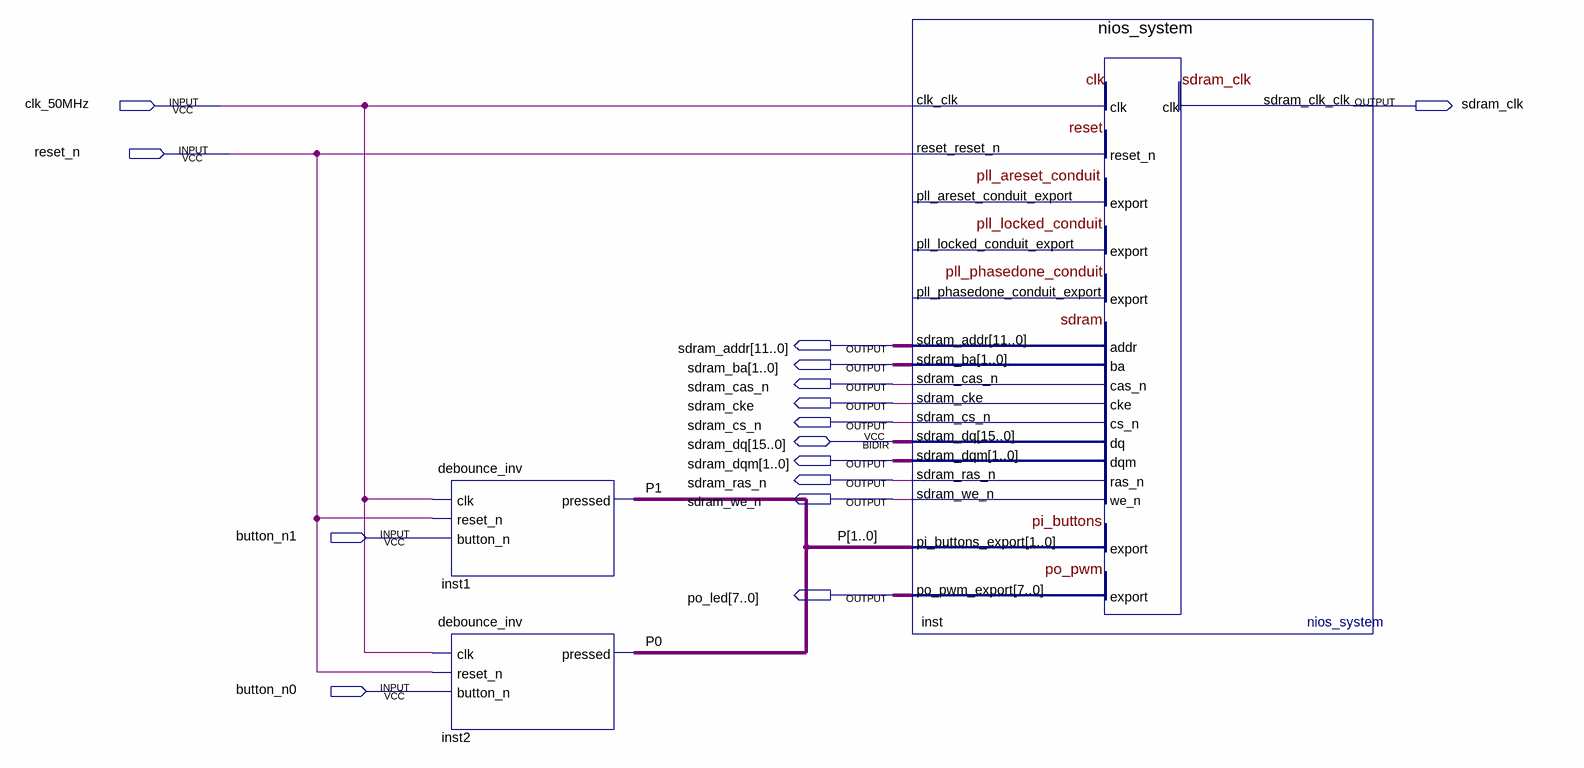
[diagram p0: schematic sheet]
// Quartus schematic nios2_crypt.bdf as structural Verilog: 3 symbols, 15 pins
module nios2_crypt (
  input  clk_50MHz,
  input  reset_n,
  input  button_n1,
  input  button_n0,
  inout  [15:0] sdram_dq,
  output sdram_clk,
  output [11:0] sdram_addr,
  output [1:0] sdram_ba,
  output sdram_cas_n,
  output sdram_cke,
  output sdram_cs_n,
  output [1:0] sdram_dqm,
  output sdram_ras_n,
  output sdram_we_n,
  output [7:0] po_led
);

  wire [1:0] P;

  debounce_inv inst1 (.clk(clk_50MHz), .reset_n(reset_n), .button_n(button_n1), .pressed(P[1]));
  debounce_inv inst2 (.clk(clk_50MHz), .reset_n(reset_n), .button_n(button_n0), .pressed(P[0]));
  nios_system inst (
    .clk_clk(clk_50MHz), .reset_reset_n(reset_n), .pi_buttons_export(P), .sdram_clk_clk(sdram_clk),
    .sdram_addr(sdram_addr), .sdram_ba(sdram_ba), .sdram_cas_n(sdram_cas_n), .sdram_cke(sdram_cke),
    .sdram_cs_n(sdram_cs_n), .sdram_dqm(sdram_dqm), .sdram_ras_n(sdram_ras_n), .sdram_we_n(sdram_we_n),
    .po_pwm_export(po_led), .sdram_dq(sdram_dq));  // open: pll_areset_conduit_export, pll_locked_conduit_export, pll_phasedone_conduit_export
endmodule
